# EAGLE design monoamp (EAGLE 6.1)
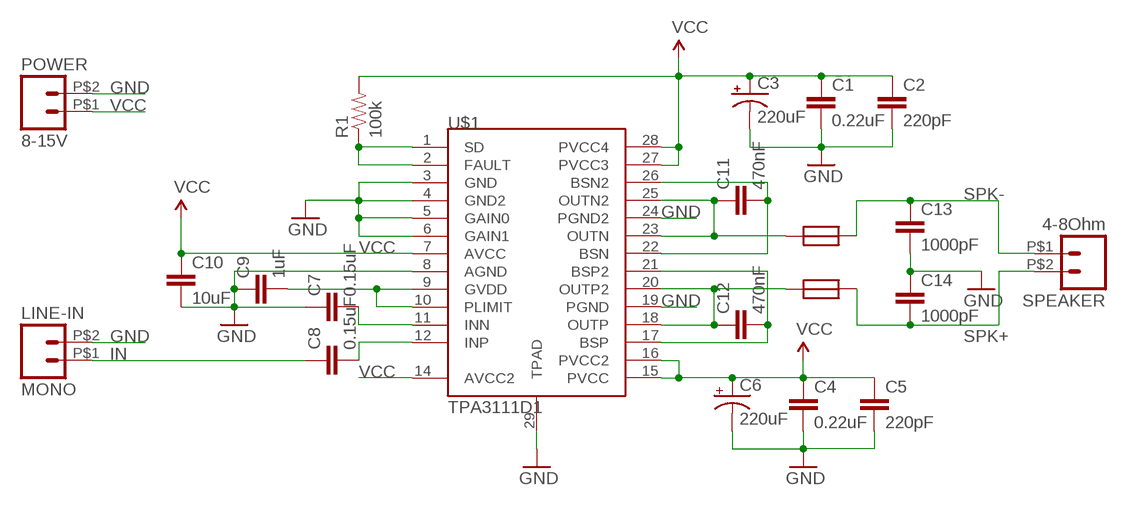
[diagram p0: schematic, sheet 1]

## Parts
C1  0.22uF  CAP0603-CAP  [0603-CAP]
C2  220pF  CAP0603-CAP  [0603-CAP]
C3  220uF  CAP_POLNICHICON-10  [NICHICON_10]
C4  0.22uF  CAP0603-CAP  [0603-CAP]
C5  220pF  CAP0603-CAP  [0603-CAP]
C6  220uF  CAP_POLNICHICON-10  [NICHICON_10]
C7  0.15uF  CAP0603-CAP  [0603-CAP]
C8  0.15uF  CAP0603-CAP  [0603-CAP]
C9  1uF  CAP0603-CAP  [0603-CAP]
C10  10uF  CAP0805  [0805]
C11  470nF  CAP0603-CAP  [0603-CAP]
C12  470nF  CAP0603-CAP  [0603-CAP]
C13  1000pF  CAP0603-CAP  [0603-CAP]
C14  1000pF  CAP0603-CAP  [0603-CAP]
LINE-IN  MONO  M02PTH2  [1X02_BIG]
POWER  8-15V  M02PTH2  [1X02_BIG]
R1  100k  RESISTOR0603-RES  [0603-RES]
SPEAKER  4-8Ohm  M02PTH2  [1X02_BIG]
U$1  TPA3111D1  [TSSOP28-GROUNDPAD]
U$2  FERRITE-BEAD28L0138-80R-10  [0138]
U$3  FERRITE-BEAD28L0138-80R-10  [0138]

## Nets
GND: C1.2 C2.2 C3.- C4.2 C5.2 C6.- C7.1 C9.1 C10.2 C13.2 C14.1 LINE-IN.P$2 POWER.P$2 U$1.3(GND) U$1.4(GND2) U$1.5(GAIN0) U$1.6(GAIN1) U$1.8(AGND) U$1.19(PGND) U$1.24(PGND2) U$1.29(TPAD)
IN: C8.1 LINE-IN.P$1
N$1: C7.2 U$1.11(INN)
N$2: C8.2 U$1.12(INP)
N$3: C9.2 U$1.9(GVDD) U$1.10(PLIMIT)
N$4: R1.1 U$1.1(SD) U$1.2(FAULT)
N$5: C11.2 U$1.22(BSN) U$1.26(BSN2)
N$6: C12.2 U$1.17(BSP) U$1.21(BSP2)
N$7: C11.1 U$1.23(OUTN) U$1.25(OUTN2) U$2.P$1
N$8: C12.1 U$1.18(OUTP) U$1.20(OUTP2) U$3.P$1
SPK+: C14.2 SPEAKER.P$2 U$3.P$2
SPK-: C13.1 SPEAKER.P$1 U$2.P$2
VCC: C1.1 C2.1 C3.+ C4.1 C5.1 C6.+ C10.1 POWER.P$1 R1.2 U$1.7(AVCC) U$1.14(AVCC2) U$1.15(PVCC) U$1.16(PVCC2) U$1.27(PVCC3) U$1.28(PVCC4)

## Library data of the parts
C1 C2 C4 C5 C7-C14 = SparkFun:CAP: Capacitor Standard 0603 ceramic capacitor, and 0.1" leaded capacitor.
C3 C6 = sak:CAP_POL: Capacitor Polarized These are standard SMD and PTH capacitors. Normally 10uF, 47uF, and 100uF in electrolytic and tantalum varieties. Always verify the external diameter of the through hole cap, it varies with capacity, voltage, and manufacturer. The EIA devices should be standard.
LINE-IN POWER SPEAKER = SparkFun:M02: Header 2 Standard 2-pin 0.1" header. Use with straight break away headers (SKU : PRT-00116), right angle break away headers (PRT-00553), swiss pins (PRT-00743), machine pins (PRT-00117), and female headers (PRT-00115). Molex polarized connector foot print use with SKU : PRT-08233 with associated crimp pins and housings.
R1 = SparkFun:RESISTOR: Resistor Basic schematic elements and footprints for 0603, 1206, and PTH resistors.
U$1 = sak:TPA3111D1
U$2 U$3 = sak:FERRITE-BEAD

## Board
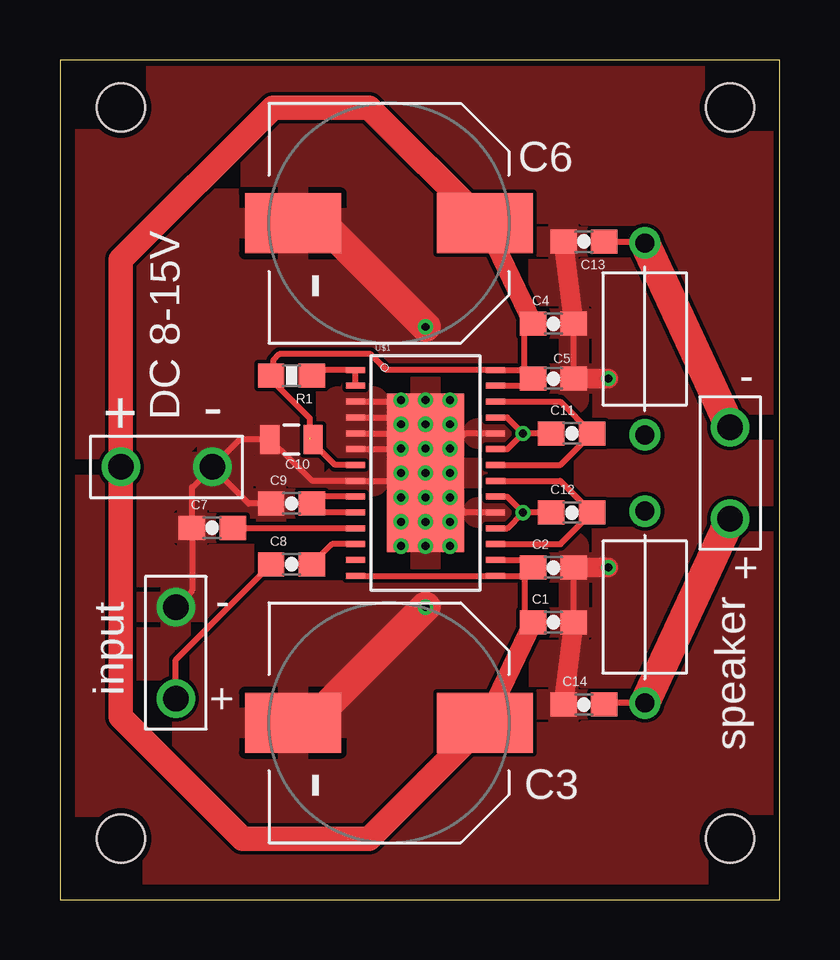
[diagram p1: board, top side]
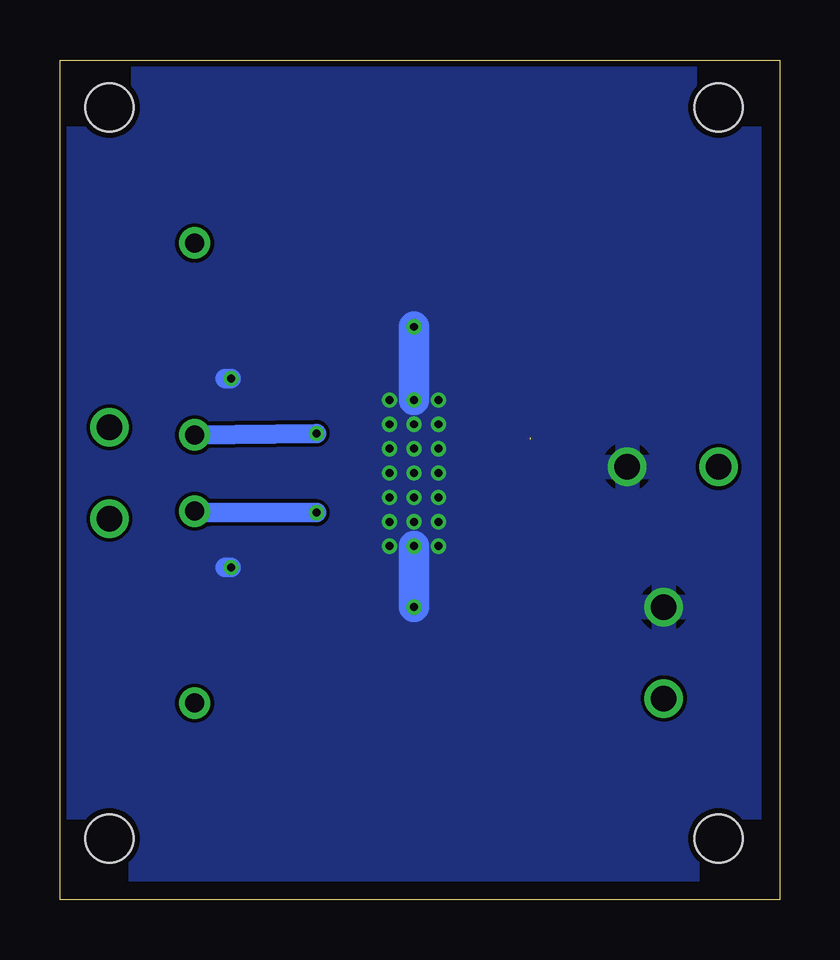
[diagram p2: board, bottom side, seen from below]

Size 30 x 35 mm. Coordinates in mm from the lower left corner, seen from the top.
Outline: 0,0 30,0 30,35 0,35 0,0
Copper layers (1*16): Top 0.035mm / dielectric 1.5mm / Bottom 0.035mm
Design rules: minimum track width 6mil, minimum drill 12mil, track to track 6mil, track to pad 6mil, pad to pad 6mil, via to via 6mil, smd to smd 0mil, copper to edge 10mil, drill to drill 10mil, minimum pad ring 10mil, minimum via ring 6mil, stop-mask expansion 2mil, vias tented up to drill 100mil, thermal gap 10mil
Holes 2 mm at 2.54,33.02 2.54,2.54 27.94,2.54 27.94,33.02

### Footprints (pad centres in the part's own frame; a part is rotated, then mirrored left to right if it is on the bottom)
0603-CAP = smd 1.1 x 1: 1 -0.85,0; 2 0.85,0
NICHICON_10 = smd 2.5 x 4: + 0,-4; - 0,4
0805 = smd 0.8 x 1.2: 1 -0.9,0; 2 0.9,0
1X02_BIG = drill 1.067: P$1 0,0; P$2 3.81,0
0603-RES = smd 1.1 x 1: 1 -0.85,0; 2 0.85,0
TSSOP28-GROUNDPAD = smd 0.8 x 0.25: 1 -2.921,4.298; 2 -2.921,3.637; 3 -2.921,2.977; 4 -2.921,2.317; 5 -2.921,1.656; 6 -2.921,0.996; 7 -2.921,0.335; 8 -2.927,-0.325; 9 -2.921,-0.985; 10 -2.921,-1.646; 11 -2.921,-2.306; 12 -2.921,-2.967; 13 -2.921,-3.627; 14 -2.921,-4.287; 15 2.921,-4.287; 16 2.921,-3.627; 17 2.921,-2.967; 18 2.921,-2.306; 19 2.921,-1.646; 20 2.921,-0.985; 21 2.927,-0.325; 22 2.921,0.335; 23 2.921,0.996; 24 2.921,1.656; 25 2.921,2.317; 26 2.921,2.977; 27 2.921,3.637; 28 2.921,4.298 | smd 3.2 x 6.6: 29 0,0.005
0138 = drill 0.8: P$1 -4,0; P$2 4,0

### Placement (x,y rotation side)
C1  20.57,11.56 0 top
C2  20.57,13.84 0 top
C3  13.72,7.37 90 top
C4  20.57,24 0 top
C5  20.57,21.72 0 top
C6  13.72,28.19 90 top
C7  6.35,15.49 0 top
C8  9.65,13.97 0 top
C9  9.65,16.51 0 top
C10  9.65,19.18 180 top
C11  21.34,19.43 0 top
C12  21.34,16.13 0 top
C13  21.84,27.43 180 top
C14  21.84,8.13 0 top
LINE-IN  4.83,8.38 90 top
POWER  2.54,18.03 0 top
R1  9.65,21.84 180 top
SPEAKER  27.94,19.68 270 top
U$1  15.24,17.78 0 top
U$2  24.38,23.37 90 top
U$3  24.38,12.19 270 top

### Tracks (layer width: path | path; a pad name or v marks a point on that pad's centre or on a via)
GND  (via drill 0.33)
  Top 0.254: C1.2 C2.2 | C5.2 C4.2 | U$1.19 16.89,16.13 U$1.29 | U$1.24 16.89,19.44 v16.25,18.8 | v16.25,18.8 U$1.29 | U$1.29 14.91,17.45 U$1.8 10.52,17.45 C10.2 7.49,19.18 POWER.P$2 | U$1.3 14.29,20.76 14.96,20.1 | v15.24,19.81 v16.25,18.8 | U$1.4 14.96,20.1 | 14.96,20.1 v15.24,19.81 | U$1.5 14.86,19.44 | 14.86,19.44 v15.24,19.81 | U$1.6 14.2,18.78 14.86,19.44 | C9.1 7.87,16.51 POWER.P$2 | POWER.P$2 5.5,17.18 C7.1 5.5,12.87 LINE-IN.P$2
  Top 0.813: C14.1 C1.2 | C13.2 C4.2 | C2.2 v22.86,13.84 | C5.2 v22.86,21.72
  Top 1.27: C3.- 10.41,7.37 v15.24,12.19 | C6.- 10.92,28.19 v15.24,23.88
  Bottom 0.813: v22.86,13.84 23.11,13.84 | v22.86,21.72 23.11,21.72
  Bottom 1.27: v15.24,12.19 v15.24,14.73 | v15.24,23.88 v15.24,20.83
  other vias: 15.24,17.78 15.24,18.8 14.22,20.83 14.22,19.81 14.22,18.8 14.22,17.78 14.22,16.76 14.22,15.75 14.22,14.73 16.26,14.73 15.24,15.75 15.24,16.76 16.26,16.76 16.26,17.78 16.26,19.81 16.26,20.83 16.26,15.75
  pour Bottom: 1.27,1.27 29.21,1.27 29.21,34.29 1.27,34.29
  pour Top: 1.27,34.29 29.21,34.29 29.21,1.27 1.27,1.27
IN
  Top 0.254: LINE-IN.P$1 4.83,9.99 C8.1
N$1
  Top 0.254: U$1.11 7.22,15.47 C7.2
N$2
  Top 0.254: U$1.12 11.35,14.81 C8.2
N$3
  Top 0.254: U$1.10 10.88,16.13 C9.2 10.79,16.8 U$1.9
N$4
  Top 0.254: U$1.2 U$1.1 10.74,22.08 R1.1
N$5
  Top 0.254: U$1.22 20.87,18.11 C11.2 20.86,20.76 U$1.26
N$6
  Top 0.254: U$1.21 20.86,17.45 C12.2 20.87,14.81 U$1.17
N$7  (via drill 0.33)
  Top 0.254: C11.1 v19.3,19.43 | U$1.25 18.64,20.1 v19.3,19.43 | U$1.23 18.65,18.78 v19.3,19.43
  Bottom 0.254: 23.81,19.43 U$2.P$1
  Bottom 0.813: v19.3,19.43 U$2.P$1
N$8  (via drill 0.33)
  Top 0.254: C12.1 v19.3,16.13 | U$1.18 18.65,15.47 v19.3,16.13 | U$1.20 18.64,16.8 v19.3,16.13
  Bottom 0.813: v19.3,16.13 23.81,16.13 U$3.P$1
SPK+
  Top 0.254: U$3.P$2 22.76,8.19 C14.2
  Top 1.27: SPEAKER.P$2 U$3.P$2
SPK-
  Top 0.254: C13.1 24.32,27.43 U$2.P$2
  Top 1.27: U$2.P$2 SPEAKER.P$1
VCC  (1 unrouted)
  Top 0.254: U$1.16 19.41,14.15 C2.1 19.37,13.49 | 19.37,13.49 U$1.15 U$1.14 | 19.37,13.49 19.37,11.91 C1.1 | 19.36,22.08 U$1.28 13.61,22.08 12.95,22.73 9.14,22.73 8.89,22.48 8.89,21.93 R1.2 8.8,21.68 10.41,20.07 10.41,19.27 C10.1 | 19.36,22.08 C5.1 19.42,21.42 U$1.27 | 19.36,22.08 19.36,23.64 C4.1 | U$1.7 11.48,18.11 10.41,19.18
  Top 0.813: C1.1 C3.+ | C4.1 C6.+
  Top 1.016: C3.+ 12.89,2.54 7.62,2.54 2.54,7.62 POWER.P$1 2.54,26.67 8.89,33.02 12.89,33.02 C6.+

### Text on the board
tPlace: - | DC 8-15V | - | + | + | - | input | + | speaker